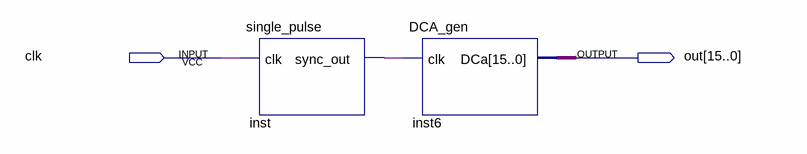
[diagram p0: schematic sheet]
// Quartus schematic lab2_var2_v1.bdf as structural Verilog: 2 symbols, 2 pins
module lab2_var2_v1 (
  input  clk,
  output [15:0] out
);

  wire inst_sync_out;

  single_pulse inst (.clk(clk), .sync_out(inst_sync_out));
  DCA_gen inst6 (.clk(inst_sync_out), .DCa(out));
endmodule
